# Altium schematic sheet DDR3L_Modules.SchDoc: DDR3L Modules
size A3; DrawnBy: Emre Can Damyanlı; Revision: A.1; SheetNumber: 8; SheetTotal: 8; ENG_APP_DATE: --/--/--; DSN_APP_DATE: --/--/--; CHK_APP_DATE: --/--/--
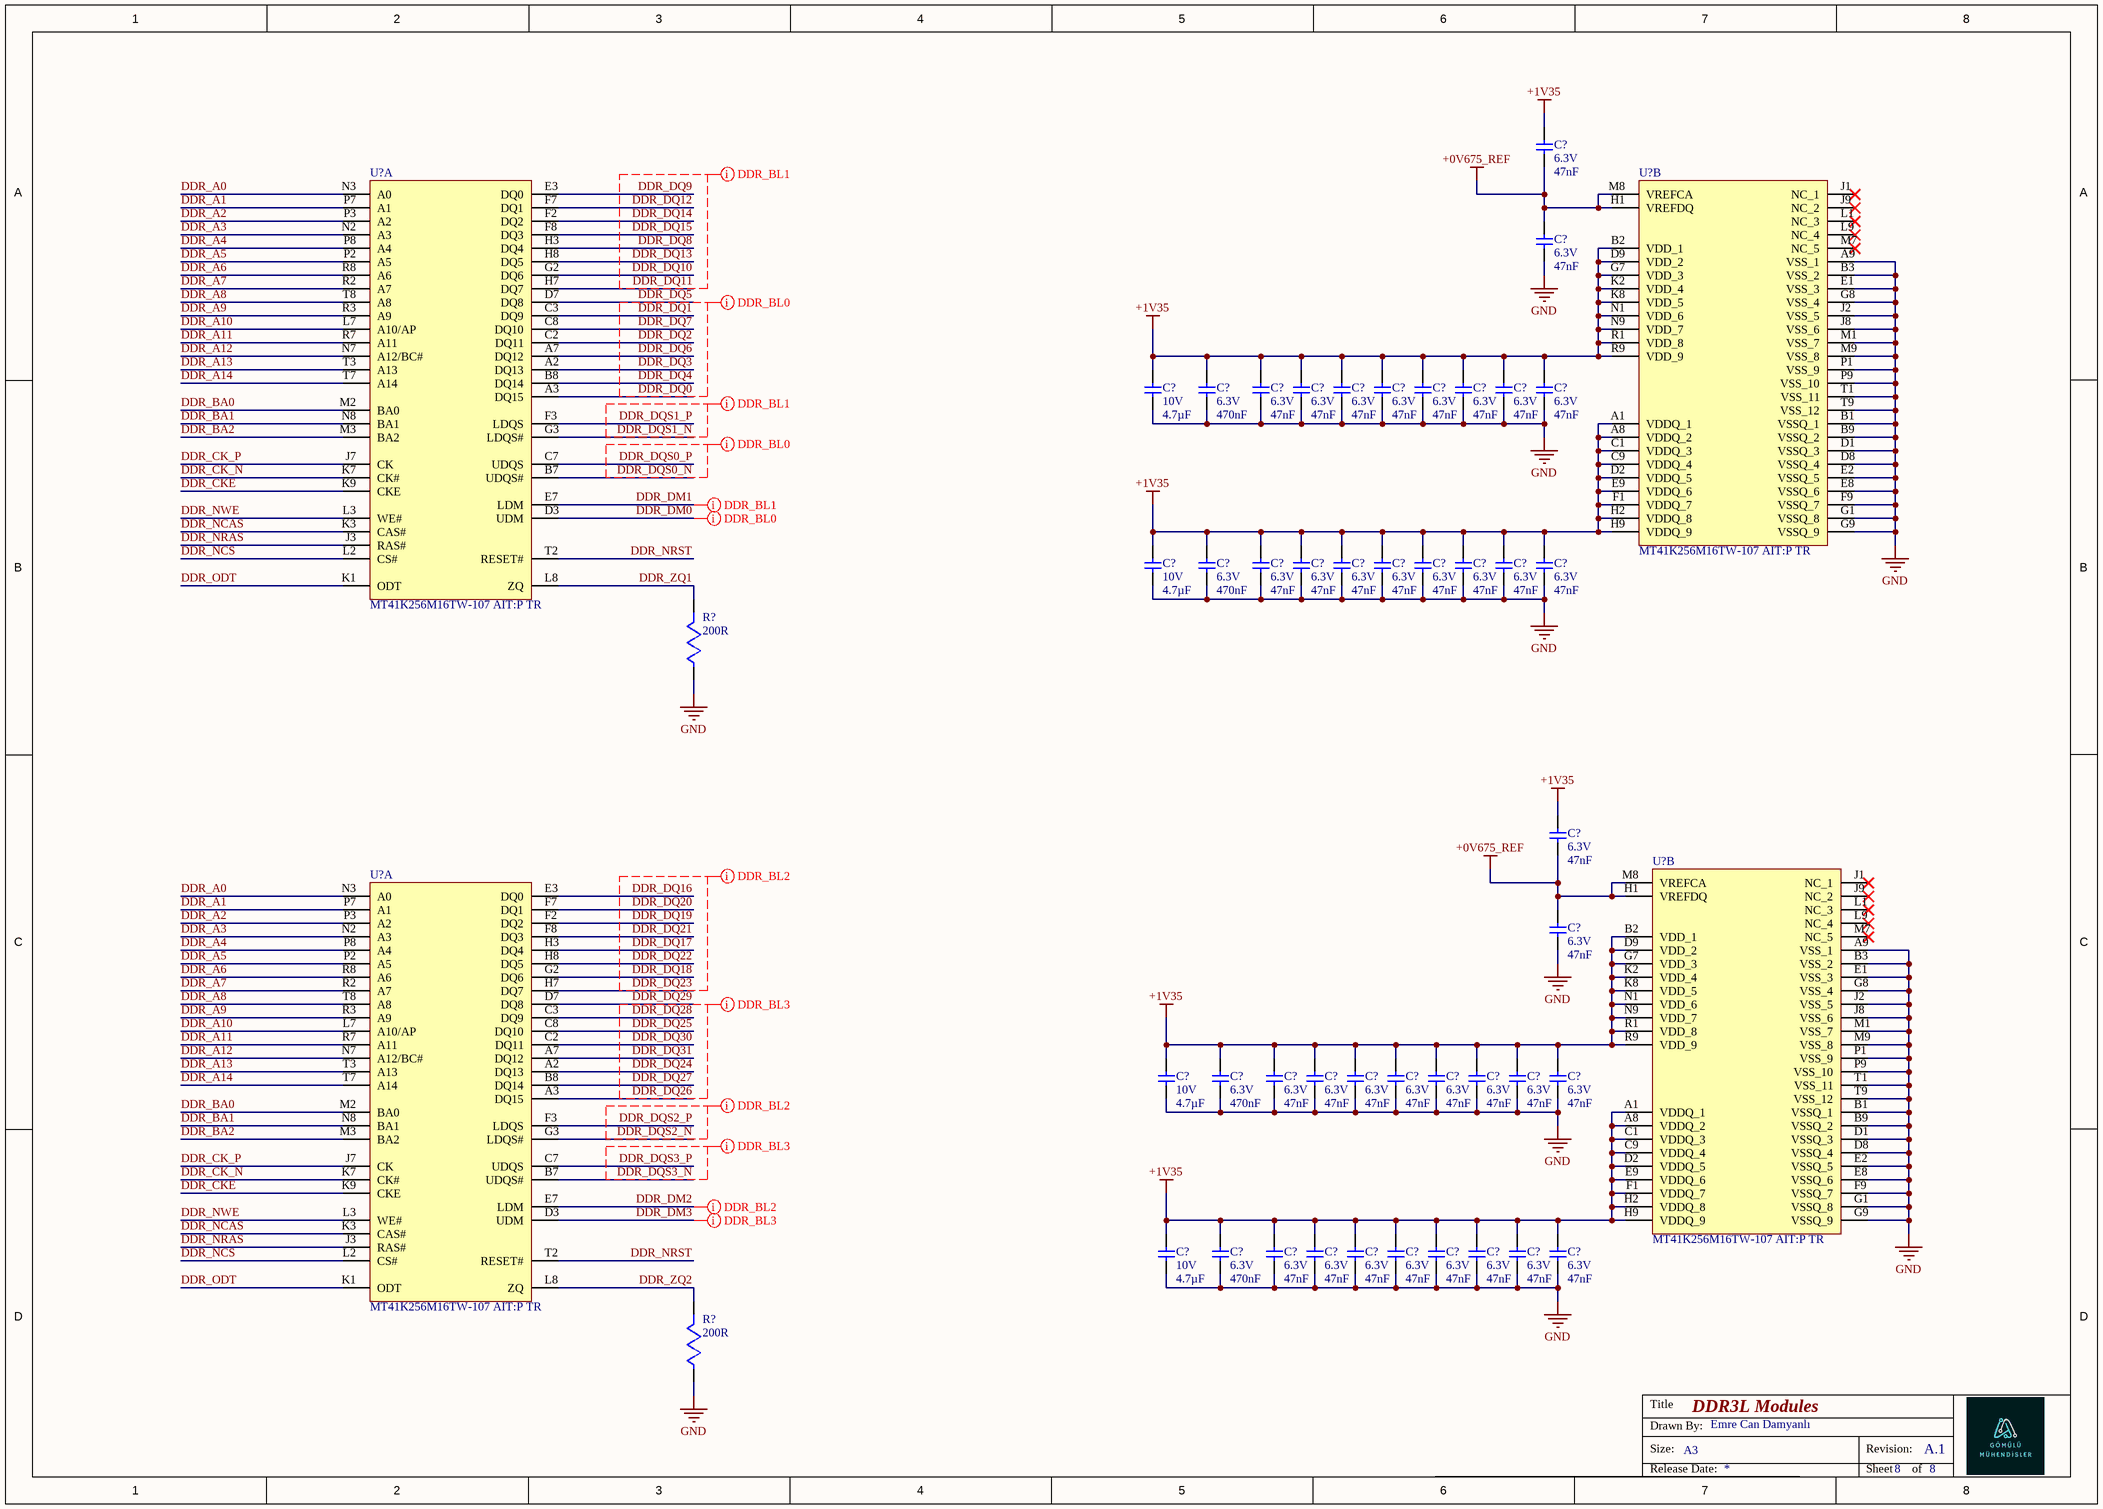
[diagram p0: DDR3L_Modules.SchDoc]

## Parts
(Parts that share a designator on the sheet are numbered #1, #2 ... from top to bottom, then left to right.)
C?#1  value 47nF  Voltage Rating: 6.3V  [CAPC0603X33N]  (hidden comment: GRM033C80J473KE19D)
C?#2  value 47nF  Voltage Rating: 6.3V  [CAPC0603X33N]  (hidden comment: GRM033C80J473KE19D)
C?#3  value 4.7µF  Voltage Rating: 10V  [CAPC1005X55N]  (hidden comment: CL05A475MP5NRNC)
C?#4  value 470nF  Voltage Rating: 6.3V  [CAPC0603X33N]  (hidden comment: GRM033R60J474KE90D)
C?#5  value 47nF  Voltage Rating: 6.3V  [CAPC0603X33N]  (hidden comment: GRM033C80J473KE19D)
C?#6  value 47nF  Voltage Rating: 6.3V  [CAPC0603X33N]  (hidden comment: GRM033C80J473KE19D)
C?#7  value 47nF  Voltage Rating: 6.3V  [CAPC0603X33N]  (hidden comment: GRM033C80J473KE19D)
C?#8  value 47nF  Voltage Rating: 6.3V  [CAPC0603X33N]  (hidden comment: GRM033C80J473KE19D)
C?#9  value 47nF  Voltage Rating: 6.3V  [CAPC0603X33N]  (hidden comment: GRM033C80J473KE19D)
C?#10  value 47nF  Voltage Rating: 6.3V  [CAPC0603X33N]  (hidden comment: GRM033C80J473KE19D)
C?#11  value 47nF  Voltage Rating: 6.3V  [CAPC0603X33N]  (hidden comment: GRM033C80J473KE19D)
C?#12  value 47nF  Voltage Rating: 6.3V  [CAPC0603X33N]  (hidden comment: GRM033C80J473KE19D)
C?#13  value 4.7µF  Voltage Rating: 10V  [CAPC1005X55N]  (hidden comment: CL05A475MP5NRNC)
C?#14  value 470nF  Voltage Rating: 6.3V  [CAPC0603X33N]  (hidden comment: GRM033R60J474KE90D)
C?#15  value 47nF  Voltage Rating: 6.3V  [CAPC0603X33N]  (hidden comment: GRM033C80J473KE19D)
C?#16  value 47nF  Voltage Rating: 6.3V  [CAPC0603X33N]  (hidden comment: GRM033C80J473KE19D)
C?#17  value 47nF  Voltage Rating: 6.3V  [CAPC0603X33N]  (hidden comment: GRM033C80J473KE19D)
C?#18  value 47nF  Voltage Rating: 6.3V  [CAPC0603X33N]  (hidden comment: GRM033C80J473KE19D)
C?#19  value 47nF  Voltage Rating: 6.3V  [CAPC0603X33N]  (hidden comment: GRM033C80J473KE19D)
C?#20  value 47nF  Voltage Rating: 6.3V  [CAPC0603X33N]  (hidden comment: GRM033C80J473KE19D)
C?#21  value 47nF  Voltage Rating: 6.3V  [CAPC0603X33N]  (hidden comment: GRM033C80J473KE19D)
C?#22  value 47nF  Voltage Rating: 6.3V  [CAPC0603X33N]  (hidden comment: GRM033C80J473KE19D)
C?#23  value 47nF  Voltage Rating: 6.3V  [CAPC0603X33N]  (hidden comment: GRM033C80J473KE19D)
C?#24  value 47nF  Voltage Rating: 6.3V  [CAPC0603X33N]  (hidden comment: GRM033C80J473KE19D)
C?#25  value 4.7µF  Voltage Rating: 10V  [CAPC1005X55N]  (hidden comment: CL05A475MP5NRNC)
C?#26  value 470nF  Voltage Rating: 6.3V  [CAPC0603X33N]  (hidden comment: GRM033R60J474KE90D)
C?#27  value 47nF  Voltage Rating: 6.3V  [CAPC0603X33N]  (hidden comment: GRM033C80J473KE19D)
C?#28  value 47nF  Voltage Rating: 6.3V  [CAPC0603X33N]  (hidden comment: GRM033C80J473KE19D)
C?#29  value 47nF  Voltage Rating: 6.3V  [CAPC0603X33N]  (hidden comment: GRM033C80J473KE19D)
C?#30  value 47nF  Voltage Rating: 6.3V  [CAPC0603X33N]  (hidden comment: GRM033C80J473KE19D)
C?#31  value 47nF  Voltage Rating: 6.3V  [CAPC0603X33N]  (hidden comment: GRM033C80J473KE19D)
C?#32  value 47nF  Voltage Rating: 6.3V  [CAPC0603X33N]  (hidden comment: GRM033C80J473KE19D)
C?#33  value 47nF  Voltage Rating: 6.3V  [CAPC0603X33N]  (hidden comment: GRM033C80J473KE19D)
C?#34  value 47nF  Voltage Rating: 6.3V  [CAPC0603X33N]  (hidden comment: GRM033C80J473KE19D)
C?#35  value 4.7µF  Voltage Rating: 10V  [CAPC1005X55N]  (hidden comment: CL05A475MP5NRNC)
C?#36  value 470nF  Voltage Rating: 6.3V  [CAPC0603X33N]  (hidden comment: GRM033R60J474KE90D)
C?#37  value 47nF  Voltage Rating: 6.3V  [CAPC0603X33N]  (hidden comment: GRM033C80J473KE19D)
C?#38  value 47nF  Voltage Rating: 6.3V  [CAPC0603X33N]  (hidden comment: GRM033C80J473KE19D)
C?#39  value 47nF  Voltage Rating: 6.3V  [CAPC0603X33N]  (hidden comment: GRM033C80J473KE19D)
C?#40  value 47nF  Voltage Rating: 6.3V  [CAPC0603X33N]  (hidden comment: GRM033C80J473KE19D)
C?#41  value 47nF  Voltage Rating: 6.3V  [CAPC0603X33N]  (hidden comment: GRM033C80J473KE19D)
C?#42  value 47nF  Voltage Rating: 6.3V  [CAPC0603X33N]  (hidden comment: GRM033C80J473KE19D)
C?#43  value 47nF  Voltage Rating: 6.3V  [CAPC0603X33N]  (hidden comment: GRM033C80J473KE19D)
C?#44  value 47nF  Voltage Rating: 6.3V  [CAPC0603X33N]  (hidden comment: GRM033C80J473KE19D)
R?#1  value 200R  [RESISTOR_0603]  (hidden comment: RC0603FR-07200RL)
R?#2  value 200R  [RESISTOR_0603]  (hidden comment: RC0603FR-07200RL)
U?#1  MT41K256M16TW-107 AIT:P TR  [BGA96C80P9X16_800X1400X120]  (part B of 2)
U?#2  MT41K256M16TW-107 AIT:P TR  [BGA96C80P9X16_800X1400X120]  (part A of 2)
U?#3  MT41K256M16TW-107 AIT:P TR  [BGA96C80P9X16_800X1400X120]  (part B of 2)
U?#4  MT41K256M16TW-107 AIT:P TR  [BGA96C80P9X16_800X1400X120]  (part A of 2)

## Nets
+0V675_REF: C?#1.1 C?#2.2 C?#23.1 C?#24.2 U?#1.H1(VREFDQ) U?#1.M8(VREFCA) U?#3.H1(VREFDQ) U?#3.M8(VREFCA)
+1V35: C?#1.2 C?#3.2 C?#4.2 C?#5.2 C?#6.2 C?#7.2 C?#8.2 C?#9.2 C?#10.2 C?#11.2 C?#12.2 C?#13.2 C?#14.2 C?#15.2 C?#16.2 C?#17.2 C?#18.2 C?#19.2 C?#20.2 C?#21.2 C?#22.2 C?#23.2 C?#25.2 C?#26.2 C?#27.2 C?#28.2 C?#29.2 C?#30.2 C?#31.2 C?#32.2 C?#33.2 C?#34.2 C?#35.2 C?#36.2 C?#37.2 C?#38.2 C?#39.2 C?#40.2 C?#41.2 C?#42.2 C?#43.2 C?#44.2 U?#1.A1(VDDQ_1) U?#1.A8(VDDQ_2) U?#1.B2(VDD_1) U?#1.C1(VDDQ_3) U?#1.C9(VDDQ_4) U?#1.D2(VDDQ_5) U?#1.D9(VDD_2) U?#1.E9(VDDQ_6) U?#1.F1(VDDQ_7) U?#1.G7(VDD_3) U?#1.H2(VDDQ_8) U?#1.H9(VDDQ_9) U?#1.K2(VDD_4) U?#1.K8(VDD_5) U?#1.N1(VDD_6) U?#1.N9(VDD_7) U?#1.R1(VDD_8) U?#1.R9(VDD_9) U?#3.A1(VDDQ_1) U?#3.A8(VDDQ_2) U?#3.B2(VDD_1) U?#3.C1(VDDQ_3) U?#3.C9(VDDQ_4) U?#3.D2(VDDQ_5) U?#3.D9(VDD_2) U?#3.E9(VDDQ_6) U?#3.F1(VDDQ_7) U?#3.G7(VDD_3) U?#3.H2(VDDQ_8) U?#3.H9(VDDQ_9) U?#3.K2(VDD_4) U?#3.K8(VDD_5) U?#3.N1(VDD_6) U?#3.N9(VDD_7) U?#3.R1(VDD_8) U?#3.R9(VDD_9)
GND: C?#2.1 C?#3.1 C?#4.1 C?#5.1 C?#6.1 C?#7.1 C?#8.1 C?#9.1 C?#10.1 C?#11.1 C?#12.1 C?#13.1 C?#14.1 C?#15.1 C?#16.1 C?#17.1 C?#18.1 C?#19.1 C?#20.1 C?#21.1 C?#22.1 C?#24.1 C?#25.1 C?#26.1 C?#27.1 C?#28.1 C?#29.1 C?#30.1 C?#31.1 C?#32.1 C?#33.1 C?#34.1 C?#35.1 C?#36.1 C?#37.1 C?#38.1 C?#39.1 C?#40.1 C?#41.1 C?#42.1 C?#43.1 C?#44.1 R?#1.1 R?#2.1 U?#1.A9(VSS_1) U?#1.B1(VSSQ_1) U?#1.B3(VSS_2) U?#1.B9(VSSQ_2) U?#1.D1(VSSQ_3) U?#1.D8(VSSQ_4) U?#1.E1(VSS_3) U?#1.E2(VSSQ_5) U?#1.E8(VSSQ_6) U?#1.F9(VSSQ_7) U?#1.G1(VSSQ_8) U?#1.G8(VSS_4) U?#1.G9(VSSQ_9) U?#1.J2(VSS_5) U?#1.J8(VSS_6) U?#1.M1(VSS_7) U?#1.M9(VSS_8) U?#1.P1(VSS_9) U?#1.P9(VSS_10) U?#1.T1(VSS_11) U?#1.T9(VSS_12) U?#3.A9(VSS_1) U?#3.B1(VSSQ_1) U?#3.B3(VSS_2) U?#3.B9(VSSQ_2) U?#3.D1(VSSQ_3) U?#3.D8(VSSQ_4) U?#3.E1(VSS_3) U?#3.E2(VSSQ_5) U?#3.E8(VSSQ_6) U?#3.F9(VSSQ_7) U?#3.G1(VSSQ_8) U?#3.G8(VSS_4) U?#3.G9(VSSQ_9) U?#3.J2(VSS_5) U?#3.J8(VSS_6) U?#3.M1(VSS_7) U?#3.M9(VSS_8) U?#3.P1(VSS_9) U?#3.P9(VSS_10) U?#3.T1(VSS_11) U?#3.T9(VSS_12)
DDR_A0: U?#2.N3(A0) U?#4.N3(A0)
DDR_A1: U?#2.P7(A1) U?#4.P7(A1)
DDR_A2: U?#2.P3(A2) U?#4.P3(A2)
DDR_A3: U?#2.N2(A3) U?#4.N2(A3)
DDR_A4: U?#2.P8(A4) U?#4.P8(A4)
DDR_A5: U?#2.P2(A5) U?#4.P2(A5)
DDR_A6: U?#2.R8(A6) U?#4.R8(A6)
DDR_A7: U?#2.R2(A7) U?#4.R2(A7)
DDR_A8: U?#2.T8(A8) U?#4.T8(A8)
DDR_A9: U?#2.R3(A9) U?#4.R3(A9)
DDR_A10: U?#2.L7(A10/AP) U?#4.L7(A10/AP)
DDR_A11: U?#2.R7(A11) U?#4.R7(A11)
DDR_A12: U?#2.N7(A12/BC#) U?#4.N7(A12/BC#)
DDR_A13: U?#2.T3(A13) U?#4.T3(A13)
DDR_A14: U?#2.T7(A14) U?#4.T7(A14)
DDR_BA0: U?#2.M2(BA0) U?#4.M2(BA0)
DDR_BA1: U?#2.N8(BA1) U?#4.N8(BA1)
DDR_BA2: U?#2.M3(BA2) U?#4.M3(BA2)
DDR_CK_N: U?#2.K7(CK#) U?#4.K7(CK#)
DDR_CK_P: U?#2.J7(CK) U?#4.J7(CK)
DDR_CKE: U?#2.K9(CKE) U?#4.K9(CKE)
DDR_DM0: U?#2.D3(UDM)
DDR_DM1: U?#2.E7(LDM)
DDR_DM2: U?#4.E7(LDM)
DDR_DM3: U?#4.D3(UDM)
DDR_DQ0: U?#2.A3(DQ15)
DDR_DQ1: U?#2.C3(DQ9)
DDR_DQ2: U?#2.C2(DQ11)
DDR_DQ3: U?#2.A2(DQ13)
DDR_DQ4: U?#2.B8(DQ14)
DDR_DQ5: U?#2.D7(DQ8)
DDR_DQ6: U?#2.A7(DQ12)
DDR_DQ7: U?#2.C8(DQ10)
DDR_DQ8: U?#2.H3(DQ4)
DDR_DQ9: U?#2.E3(DQ0)
DDR_DQ10: U?#2.G2(DQ6)
DDR_DQ11: U?#2.H7(DQ7)
DDR_DQ12: U?#2.F7(DQ1)
DDR_DQ13: U?#2.H8(DQ5)
DDR_DQ14: U?#2.F2(DQ2)
DDR_DQ15: U?#2.F8(DQ3)
DDR_DQ16: U?#4.E3(DQ0)
DDR_DQ17: U?#4.H3(DQ4)
DDR_DQ18: U?#4.G2(DQ6)
DDR_DQ19: U?#4.F2(DQ2)
DDR_DQ20: U?#4.F7(DQ1)
DDR_DQ21: U?#4.F8(DQ3)
DDR_DQ22: U?#4.H8(DQ5)
DDR_DQ23: U?#4.H7(DQ7)
DDR_DQ24: U?#4.A2(DQ13)
DDR_DQ25: U?#4.C8(DQ10)
DDR_DQ26: U?#4.A3(DQ15)
DDR_DQ27: U?#4.B8(DQ14)
DDR_DQ28: U?#4.C3(DQ9)
DDR_DQ29: U?#4.D7(DQ8)
DDR_DQ30: U?#4.C2(DQ11)
DDR_DQ31: U?#4.A7(DQ12)
DDR_DQS0_N: U?#2.B7(UDQS#)
DDR_DQS0_P: U?#2.C7(UDQS)
DDR_DQS1_N: U?#2.G3(LDQS#)
DDR_DQS1_P: U?#2.F3(LDQS)
DDR_DQS2_N: U?#4.G3(LDQS#)
DDR_DQS2_P: U?#4.F3(LDQS)
DDR_DQS3_N: U?#4.B7(UDQS#)
DDR_DQS3_P: U?#4.C7(UDQS)
DDR_NCAS: U?#2.K3(CAS#) U?#4.K3(CAS#)
DDR_NCS: U?#2.L2(CS#) U?#4.L2(CS#)
DDR_NRAS: U?#2.J3(RAS#) U?#4.J3(RAS#)
DDR_NRST: U?#2.T2(RESET#) U?#4.T2(RESET#)
DDR_NWE: U?#2.L3(WE#) U?#4.L3(WE#)
DDR_ODT: U?#2.K1(ODT) U?#4.K1(ODT)
DDR_ZQ1: R?#1.2 U?#2.L8(ZQ)
DDR_ZQ2: R?#2.2 U?#4.L8(ZQ)

Not connected (* = marked no-connect by the designer): U?#1 J1(NC_1)* J9(NC_2)* L1(NC_3)* L9(NC_4)* M7(NC_5)*; U?#3 J1(NC_1)* J9(NC_2)* L1(NC_3)* L9(NC_4)* M7(NC_5)*

## Layout directives
mark named DDR_BL1: DDR_DM1, DDR_DQ8, DDR_DQ9, DDR_DQ10, DDR_DQ11, DDR_DQ12, DDR_DQ13, DDR_DQ14, DDR_DQ15, DDR_DQS1_N, DDR_DQS1_P
mark named DDR_BL0: DDR_DM0, DDR_DQ0, DDR_DQ1, DDR_DQ2, DDR_DQ3, DDR_DQ4, DDR_DQ5, DDR_DQ6, DDR_DQ7, DDR_DQS0_N, DDR_DQS0_P
mark named DDR_BL2: DDR_DM2, DDR_DQ16, DDR_DQ17, DDR_DQ18, DDR_DQ19, DDR_DQ20, DDR_DQ21, DDR_DQ22, DDR_DQ23, DDR_DQS2_N, DDR_DQS2_P
mark named DDR_BL3: DDR_DM3, DDR_DQ24, DDR_DQ25, DDR_DQ26, DDR_DQ27, DDR_DQ28, DDR_DQ29, DDR_DQ30, DDR_DQ31, DDR_DQS3_N, DDR_DQS3_P

## Notes on the sheet
- Title
- Size:
- Drawn By:
- A3
- Revision:
- Release Date:
- Sheet
- of

## Library data of the parts
C?#1 C?#2 C?#5-C?#12 C?#15-C?#24 C?#27-C?#34 C?#37-C?#44 = GRM033C80J473KE19D: 6.3V 47nF X6S ±10% 0201 Multilayer Ceramic Capacitors MLCC - SMD/SMT ROHS; Manufacturer: Murata; Manufacturer Lifecycle Status: IN PRODUCTION; Supplier: Arrow Electronics; Supplier Part Number: GRM033C80J473KE19D; Manufacturer Part Number: GRM033C80J473KE19D; RoHS: Compliant; Category: Ceramic Capacitors; Stock: 1925; Pricing: 1924=0,0007 (USD); Case/Package: 0201; Case Code (Imperial): 0201; Case Code (Metric): 0603; Depth: 300µm; Dielectric: X6S; Dielectric Material: Ceramic; Height: 300µm; Lead Free: Lead Free; Length: 600µm; Lifecycle Status: Production; Material: Ceramic; Max Operating Temperature: 105°C; Min Operating Temperature: -55°C; Mounting Technology: Surface Mount; Number of Terminals: 2; Radiation Hardening: No; REACH SVHC: Yes; Schedule B: 8532240020, 8532240020|8532240020|8532240020|8532240020|8532240020; Termination: SMD/SMT; Thickness: 300µm; Tolerance: 10%; Voltage Rating (DC): 6.3V; Width: 300µm; ComponentLink1URL: https://datasheet.octopart.com:443/GRM033C80J473KE19D-Murata-datasheet-14396169.pdf?src-supplier=Future+Electronics; ComponentLink1Description: https://datasheet.octopart.com:443/GRM033C80J473KE19D-Murata-datasheet-14396169.pdf?src-supplier=Future+Electronics; ComponentLink2URL: https://datasheet.octopart.com:443/GRM033C80J473KE19D-Murata-datasheet-96971104.pdf?src-supplier=Future+Electronics; ComponentLink2Description: https://datasheet.octopart.com:443/GRM033C80J473KE19D-Murata-datasheet-96971104.pdf?src-supplier=Future+Electronics; ComponentLink3URL: https://datasheet.octopart.com:443/GRM033C80J473KE19D-Murata-datasheet-22122223.pdf?src-supplier=Future+Electronics; ComponentLink3Description: https://datasheet.octopart.com:443/GRM033C80J473KE19D-Murata-datasheet-22122223.pdf?src-supplier=Future+Electronics; ComponentLink4URL: https://datasheet.octopart.com:443/GRM033C80J473KE19D-Murata-datasheet-44105362.pdf?src-supplier=Future+Electronics; ComponentLink4Description: https://datasheet.octopart.com:443/GRM033C80J473KE19D-Murata-datasheet-44105362.pdf?src-supplier=Future+Electronics; ComponentLink5URL: https://datasheet.octopart.com:443/GRM033C80J473KE19D-Murata-datasheet-165579666.pdf?src-supplier=TME; ComponentLink5Description: https://datasheet.octopart.com:443/GRM033C80J473KE19D-Murata-datasheet-165579666.pdf?src-supplier=TME; ComponentLink6URL: https://datasheet.octopart.com:443/GRM033C80J473KE19D-Murata-datasheet-141274201.pdf?src-supplier=Ciiva; ComponentLink6Description: https://datasheet.octopart.com:443/GRM033C80J473KE19D-Murata-datasheet-141274201.pdf?src-supplier=Ciiva; ComponentLink7URL: https://datasheet.octopart.com:443/GRM033C80J473KE19D-Murata-datasheet-140675416.pdf?src-supplier=Ciiva; ComponentLink7Description: https://datasheet.octopart.com:443/GRM033C80J473KE19D-Murata-datasheet-140675416.pdf?src-supplier=Ciiva; ComponentLink8URL: https://datasheet.octopart.com:443/GRM033C80J473KE19D-Murata-datasheet-138738209.pdf?src-supplier=Ciiva; ComponentLink8Description: https://datasheet.octopart.com:443/GRM033C80J473KE19D-Murata-datasheet-138738209.pdf?src-supplier=Ciiva; ComponentLink9URL: https://datasheet.octopart.com:443/GRM033C80J473KE19D-Murata-datasheet-32479577.pdf?src-supplier=HQonline; ComponentLink9Description: https://datasheet.octopart.com:443/GRM033C80J473KE19D-Murata-datasheet-32479577.pdf?src-supplier=HQonline; ComponentLink10URL: https://datasheet.octopart.com/GRM033C80J473KE19D-Murata-datasheet-12515295.pdf; ComponentLink10Description: https://datasheet.octopart.com/GRM033C80J473KE19D-Murata-datasheet-12515295.pdf; ComponentLink11URL: https://datasheet.octopart.com/GRM033C80J473KE19D-Murata-datasheet-12510076.pdf; ComponentLink11Description: https://datasheet.octopart.com/GRM033C80J473KE19D-Murata-datasheet-12510076.pdf; ComponentLink12URL: https://datasheet.octopart.com/GRM033C80J473KE19D-Murata-datasheet-11978611.pdf; ComponentLink12Description: https://datasheet.octopart.com/GRM033C80J473KE19D-Murata-datasheet-11978611.pdf; ComponentLink13URL: https://datasheet.octopart.com/GRM033C80J473KE19D-Murata-datasheet-10025737.pdf; ComponentLink13Description: https://datasheet.octopart.com/GRM033C80J473KE19D-Murata-datasheet-10025737.pdf; ComponentLink14URL: https://datasheet.octopart.com/GRM033C80J473KE19D-Murata-datasheet-8819587.pdf; ComponentLink14Description: https://datasheet.octopart.com/GRM033C80J473KE19D-Murata-datasheet-8819587.pdf; ComponentLink15URL: https://datasheet.octopart.com:443/GRM033C80J473KE19D-Murata-datasheet-150009104.pdf?src-supplier=Arrow.cn; ComponentLink15Description: https://datasheet.octopart.com:443/GRM033C80J473KE19D-Murata-datasheet-150009104.pdf?src-supplier=Arrow.cn; ComponentLink16URL: http://sigma.octopart.com:80/reach_statement/Murata-company-16.pdf?src-supplier=Compliance+Statements; ComponentLink16Description: http://sigma.octopart.com:80/reach_statement/Murata-company-16.pdf?src-supplier=Compliance+Statements
C?#3 C?#13 C?#25 C?#35 = CL05A475MP5NRNC: Ceramic Capacitor, Multilayer, Ceramic, 10V, 20% +Tol, 20% -Tol, X5R, +-15% TC, 4.7uF, Surface Mount, 0402 inch; Manufacturer: Samsung Electro-Mechanics; Supplier: Avnet; Supplier Part Number: CL05A475MP5NRNC; Manufacturer Part Number: CL05A475MP5NRNC; RoHS: Compliant; Category: Ceramic Capacitors; Stock: 40000; Pricing: 10000=0,00671, 20000=0,00663, 40000=0,0066, 80000=0,00656, 160000=0,00653 (USD); Case/Package: 0402; Case Code (Imperial): 0402; Case Code (Metric): 1005; China RoHS: Compliant; Dielectric: X5R; Dielectric Material: Ceramic; Height: 500µm; Lead Free: Lead Free; Length: 1mm; Lifecycle Status: Production; Material: Ceramic; Max Operating Temperature: 85°C; Min Operating Temperature: -55°C; Mounting Technology: Surface Mount; Number of Terminals: 2; REACH SVHC: Yes; Schedule B: 8532240020, 8532240020|8532240020|8532240020|8532240020|8532240020|8532240020|8532240020|8532240020|8532240020|8532240020|8532240020|8532240020|8532240020|8532240020|8532240020|8532240020|8532240020|8532240020|8532240020|8532240020|8532240020|8532240020, 8532240020|8532240020|8532240020|8532240020|8532240020|8532240020|8532240020|8532240020|8532240020|8532240020|8532240020|8532240020|8532240020|8532240020|8532240020|8532240020|8532240020|8532240020|8532240020|8532240020|8532240020|8532240020|8532240020, 8532240020|8532240020|8532240020|8532240020|8532240020|8532240020|8532240020|8532240020|8532240020|8532240020|8532240020|8532240020|8532240020|8532240020|8532240020|8532240020|8532240020|8532240020|8532240020|8532240020|8532240020|8532240020|8532240020|85; Thickness: 558.8µm; Tolerance: 20%; Voltage Rating (DC): 10V; Width: 500µm; ComponentLink1URL: https://datasheet.octopart.com:443/CL05A475MP5NRNC-Samsung-Electro-Mechanics-datasheet-181551186.pdf?src-supplier=Newark; ComponentLink1Description: https://datasheet.octopart.com:443/CL05A475MP5NRNC-Samsung-Electro-Mechanics-datasheet-181551186.pdf?src-supplier=Newark; ComponentLink2URL: https://datasheet.octopart.com:443/CL05A475MP5NRNC-Samsung-Electro-Mechanics-datasheet-136482298.pdf?src-supplier=Newark; ComponentLink2Description: https://datasheet.octopart.com:443/CL05A475MP5NRNC-Samsung-Electro-Mechanics-datasheet-136482298.pdf?src-supplier=Newark; ComponentLink3URL: https://datasheet.octopart.com:443/CL05A475MP5NRNC-Samsung-Electro-Mechanics-datasheet-136031736.pdf?src-supplier=Future+Electronics; ComponentLink3Description: https://datasheet.octopart.com:443/CL05A475MP5NRNC-Samsung-Electro-Mechanics-datasheet-136031736.pdf?src-supplier=Future+Electronics; ComponentLink4URL: https://datasheet.octopart.com:443/CL05A475MP5NRNC-Samsung-Electro-Mechanics-datasheet-110226226.pdf?src-supplier=Future+Electronics; ComponentLink4Description: https://datasheet.octopart.com:443/CL05A475MP5NRNC-Samsung-Electro-Mechanics-datasheet-110226226.pdf?src-supplier=Future+Electronics; ComponentLink5URL: https://datasheet.octopart.com:443/CL05A475MP5NRNC-Samsung-Electro-Mechanics-datasheet-87580058.pdf?src-supplier=Future+Electronics; ComponentLink5Description: https://datasheet.octopart.com:443/CL05A475MP5NRNC-Samsung-Electro-Mechanics-datasheet-87580058.pdf?src-supplier=Future+Electronics; ComponentLink6URL: https://datasheet.octopart.com:443/CL05A475MP5NRNC-Samsung-Electro-Mechanics-datasheet-81461611.pdf?src-supplier=Future+Electronics; ComponentLink6Description: https://datasheet.octopart.com:443/CL05A475MP5NRNC-Samsung-Electro-Mechanics-datasheet-81461611.pdf?src-supplier=Future+Electronics; ComponentLink7URL: https://datasheet.octopart.com:443/CL05A475MP5NRNC-Samsung-datasheet-48647200.pdf?src-supplier=Future+Electronics; ComponentLink7Description: https://datasheet.octopart.com:443/CL05A475MP5NRNC-Samsung-datasheet-48647200.pdf?src-supplier=Future+Electronics; ComponentLink8URL: https://datasheet.octopart.com:443/CL05A475MP5NRNC-Samsung-datasheet-34153549.pdf?src-supplier=Future+Electronics; ComponentLink8Description: https://datasheet.octopart.com:443/CL05A475MP5NRNC-Samsung-datasheet-34153549.pdf?src-supplier=Future+Electronics; ComponentLink9URL: https://datasheet.octopart.com:443/CL05A475MP5NRNC-Samsung-datasheet-26589015.pdf?src-supplier=Future+Electronics; ComponentLink9Description: https://datasheet.octopart.com:443/CL05A475MP5NRNC-Samsung-datasheet-26589015.pdf?src-supplier=Future+Electronics; ComponentLink10URL: https://datasheet.octopart.com:443/CL05A475MP5NRNC-Samsung-datasheet-8324245.pdf?src-supplier=Future+Electronics; ComponentLink10Description: https://datasheet.octopart.com:443/CL05A475MP5NRNC-Samsung-datasheet-8324245.pdf?src-supplier=Future+Electronics; ComponentLink11URL: https://datasheet.octopart.com:443/CL05A475MP5NRNC-Samsung-Electro-Mechanics-datasheet-149136695.pdf?src-supplier=Future+Electronics; ComponentLink11Description: https://datasheet.octopart.com:443/CL05A475MP5NRNC-Samsung-Electro-Mechanics-datasheet-149136695.pdf?src-supplier=Future+Electronics; ComponentLink12URL: https://datasheet.octopart.com:443/CL05A475MP5NRNC-Samsung-datasheet-8326407.pdf?src-supplier=TME; ComponentLink12Description: https://datasheet.octopart.com:443/CL05A475MP5NRNC-Samsung-datasheet-8326407.pdf?src-supplier=TME
C?#4 C?#14 C?#26 C?#36 = GRM033R60J474KE90D: Ceramic Capacitor, Ceramic, 6.3V, 10% +Tol, 10% -Tol, X5R, 15% TC, 0.47uF, Surface Mount, 0201; Manufacturer: Murata; Manufacturer Lifecycle Status: IN PRODUCTION; Supplier: Arrow Electronics; Supplier Part Number: GRM033R60J474KE90D; Manufacturer Part Number: GRM033R60J474KE90D; RoHS: Compliant; Category: Ceramic Capacitors; Stock: 1170000; Pricing: 15000=0,004 (USD); Case/Package: 0201; Case Code (Imperial): 0201; Case Code (Metric): 0603; Depth: 300µm; Dielectric: X5R; Dielectric Material: Ceramic; Height: 300µm; Lead Free: Lead Free; Length: 600µm; Lifecycle Status: Production; Material: Ceramic; Max Operating Temperature: 85°C; Min Operating Temperature: -55°C; Mounting Technology: Surface Mount; Number of Terminals: 2; Packaging: Tape & Reel (TR); REACH SVHC: Yes; Schedule B: 8532240020, 8532240020|8532240020, 8532240020|8532240020|8532240020, 8532240020|8532240020|8532240020|8532240020; Termination: SMD/SMT; Thickness: 300µm; Tolerance: 10%; Voltage Rating (DC): 6.3V; Weight: 340.194278µg; Width: 300µm; ComponentLink1URL: https://datasheet.octopart.com:443/GRM033R60J474KE90D-Murata-datasheet-165579666.pdf?src-supplier=TME; ComponentLink1Description: https://datasheet.octopart.com:443/GRM033R60J474KE90D-Murata-datasheet-165579666.pdf?src-supplier=TME; ComponentLink2URL: https://datasheet.octopart.com:443/GRM033R60J474KE90D-Murata-datasheet-141274201.pdf?src-supplier=Ciiva; ComponentLink2Description: https://datasheet.octopart.com:443/GRM033R60J474KE90D-Murata-datasheet-141274201.pdf?src-supplier=Ciiva; ComponentLink3URL: https://datasheet.octopart.com:443/GRM033R60J474KE90D-Murata-datasheet-140676048.pdf?src-supplier=Ciiva; ComponentLink3Description: https://datasheet.octopart.com:443/GRM033R60J474KE90D-Murata-datasheet-140676048.pdf?src-supplier=Ciiva; ComponentLink4URL: https://datasheet.octopart.com:443/GRM033R60J474KE90D-Murata-datasheet-138738366.pdf?src-supplier=Ciiva; ComponentLink4Description: https://datasheet.octopart.com:443/GRM033R60J474KE90D-Murata-datasheet-138738366.pdf?src-supplier=Ciiva; ComponentLink5URL: https://datasheet.octopart.com:443/GRM033R60J474KE90D-Murata-datasheet-22122223.pdf?src-supplier=Future+Electronics; ComponentLink5Description: https://datasheet.octopart.com:443/GRM033R60J474KE90D-Murata-datasheet-22122223.pdf?src-supplier=Future+Electronics; ComponentLink6URL: https://datasheet.octopart.com/GRM033R60J474KE90D-Murata-datasheet-12515295.pdf; ComponentLink6Description: https://datasheet.octopart.com/GRM033R60J474KE90D-Murata-datasheet-12515295.pdf; ComponentLink7URL: https://datasheet.octopart.com/GRM033R60J474KE90D-Murata-datasheet-12510076.pdf; ComponentLink7Description: https://datasheet.octopart.com/GRM033R60J474KE90D-Murata-datasheet-12510076.pdf; ComponentLink8URL: https://datasheet.octopart.com/GRM033R60J474KE90D-Murata-datasheet-11978611.pdf; ComponentLink8Description: https://datasheet.octopart.com/GRM033R60J474KE90D-Murata-datasheet-11978611.pdf; ComponentLink9URL: https://datasheet.octopart.com/GRM033R60J474KE90D-Murata-datasheet-10025737.pdf; ComponentLink9Description: https://datasheet.octopart.com/GRM033R60J474KE90D-Murata-datasheet-10025737.pdf; ComponentLink10URL: https://datasheet.octopart.com/GRM033R60J474KE90D-Murata-datasheet-8819587.pdf; ComponentLink10Description: https://datasheet.octopart.com/GRM033R60J474KE90D-Murata-datasheet-8819587.pdf; ComponentLink11URL: https://datasheet.octopart.com/GRM033R60J474KE90D-Murata-datasheet-17503195.pdf; ComponentLink11Description: https://datasheet.octopart.com/GRM033R60J474KE90D-Murata-datasheet-17503195.pdf; ComponentLink12URL: https://datasheet.octopart.com:443/GRM033R60J474KE90D-Murata-datasheet-150839311.pdf?src-supplier=Arrow.cn; ComponentLink12Description: https://datasheet.octopart.com:443/GRM033R60J474KE90D-Murata-datasheet-150839311.pdf?src-supplier=Arrow.cn; ComponentLink13URL: http://sigma.octopart.com:80/reach_statement/Murata-company-16.pdf?src-supplier=Compliance+Statements; ComponentLink13Description: http://sigma.octopart.com:80/reach_statement/Murata-company-16.pdf?src-supplier=Compliance+Statements
R?#1 R?#2 = RC0603FR-07200RL: SMD Chip Resistor, 200 Ohm, ± 1%, 100 mW, 0603 [1608 Metric], Thick Film, General Purpose; Manufacturer: Yageo; Power Rating: 100mW; Voltage Rating: 50V; Temperature Coefficient: 100ppm/°C; Working Voltage: 75V; Supplier: Digikey; Supplier Part Number: 311-200HRCT-ND; Manufacturer Part Number: RC0603FR-07200RL; RoHS: Yes; Category: Chip SMD Resistors; Stock: 439500; Pricing: 1=0,1, 10=0,019, 50=0,0112, 100=0,0093, 500=0,00622, 1000=0,00532 (USD); Case/Package: 0603; Pins: 2; Case Code (Imperial): 0603; Case Code (Metric): 1608; Min Operating Temperature: -55°C; Max Operating Temperature: 155°C; Packaging: Tape and Reel; Tolerance: 1%; Package Quantity: 5000; Termination: SMD/SMT; Resistor Type: Thick Film; Number of Terminations: 2; Features: Moisture Resistant; Series: RC; Max Power Dissipation: 100mW; Resistance Tolerance: 1%; Construction: Rectangular; Technology: THICK FILM; Voltage Rating (DC): 50V; Length: 1.6mm; Width: 0.8mm; Height: 0.45mm; Depth: 0.8mm; Reach SVHC Compliant: No; Military Standard: Not; Lead Free: Lead Free; RoHS Compliant: Yes; ComponentLink1URL: https://datasheet.ciiva.com/11809/0900766b80f96399-11809240.pdf?src-supplier=Rs; ComponentLink1Description: https://datasheet.ciiva.com/11809/0900766b80f96399-11809240.pdf?src-supplier=Rs; ComponentLink2URL: https://datasheet.ciiva.com/46395/443971-46395029.pdf?src-supplier=Element14; ComponentLink2Description: https://datasheet.ciiva.com/46395/443971-46395029.pdf?src-supplier=Element14
U?#1-U?#4 = MT41K256M16TW-107 AIT:P TR: 1.45 V 4 Gbit Parallel 933 MHz 20 ns SMT V00H SDRAM DDR3L Memory IC - FBGA-96; Manufacturer: Micron; Frequency: 933MHz; Memory Format: RAM, SDRAM; Supplier: Future Electronics; Supplier Part Number: 2197819; RoHS: Compliant; Category: RAM; Pricing: 2000=12,36 (USD); Case/Package: TFBGA; Interface: Parallel; Max Operating Temperature: 95°C; Min Operating Temperature: -40°C; ComponentLink1URL: https://datasheet.octopart.com:443/MT41K256M16TW-107-AIT%3AP-TR-Micron-datasheet-165810451.pdf?src-supplier=SHENGYU+ELECTRONICS; ComponentLink1Description: https://datasheet.octopart.com:443/MT41K256M16TW-107-AIT%3AP-TR-Micron-datasheet-165810451.pdf?src-supplier=SHENGYU+ELECTRONICS; Manufacturer Part Number: MT41K256M16TW-107 AIT:P TR